# EAGLE schematic MegaShield (EAGLE 8.5.1)
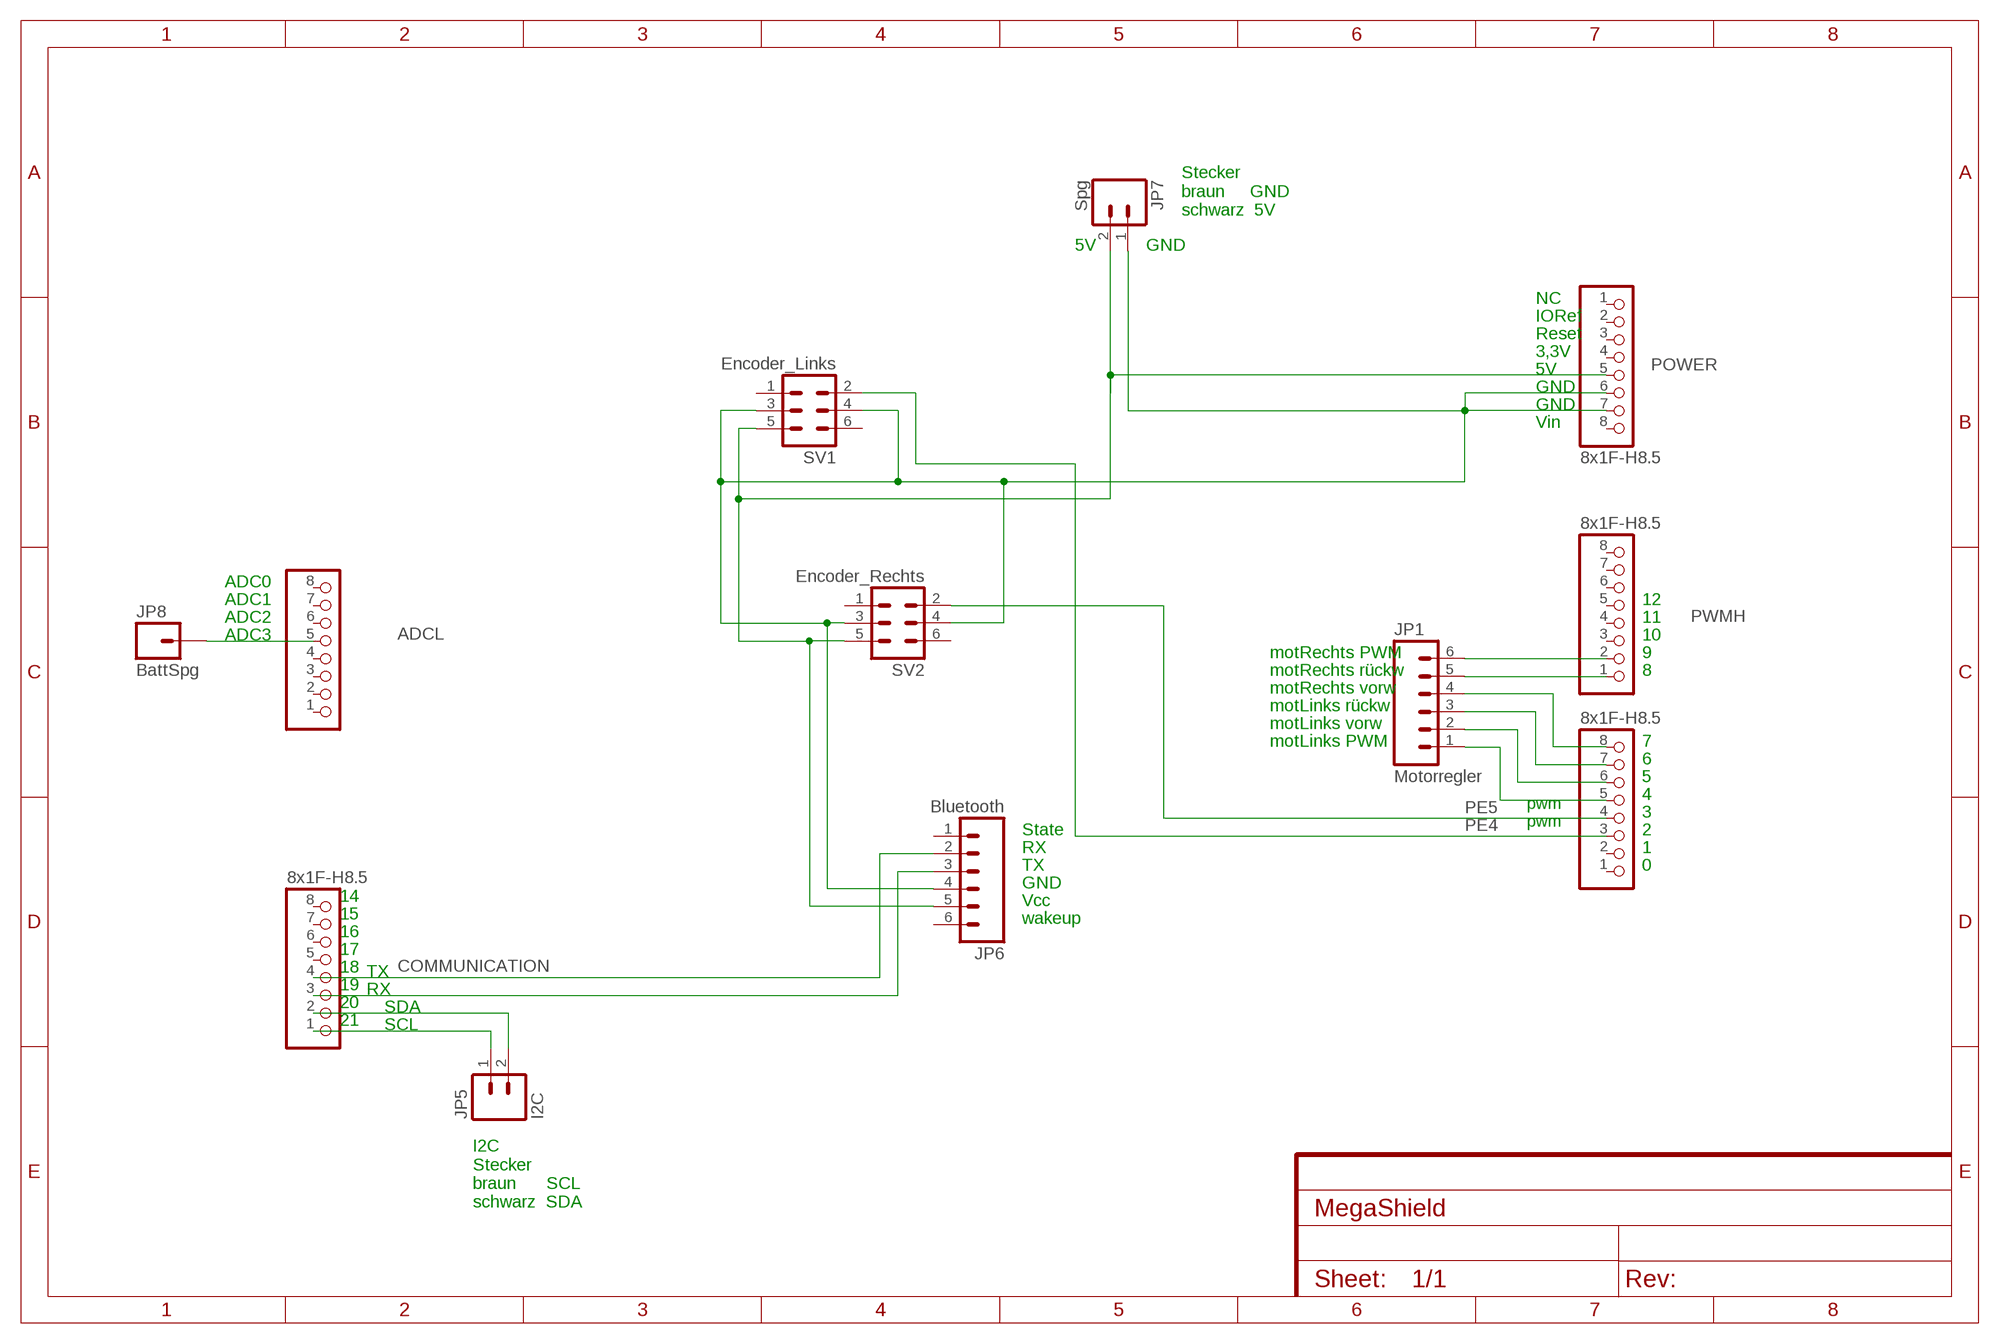
[diagram p0: schematic, sheet 1]

## Parts
ADCL  8x1F-H8.5  PINHD-1X8  [1X08]
COMMUNICATION  8x1F-H8.5  PINHD-1X8  [1X08]
JP1  Motorregler  M06LOCK  [1X06_LOCK]
JP5  I2C  M02-JST-2MM-SMT  [JST-2-SMD]
JP6  Bluetooth  M06LOCK  [1X06_LOCK]
JP7  Spg  M02-JST-2MM-SMT  [JST-2-SMD]
JP8  BattSpg  M01PTH  [1X01]
POWER  8x1F-H8.5  PINHD-1X8  [1X08]
PWMH  8x1F-H8.5  PINHD-1X8  [1X08]
PWML  8x1F-H8.5  PINHD-1X8  [1X08]
SV1  Encoder_Links  ML6  [ML6]
SV2  Encoder_Rechts  ML6  [ML6]

## Nets
N$1 [power usb]: JP6.5 JP7.2 POWER.5 SV1.5 SV2.5
N$2 [gnd]: JP6.4 JP7.1 POWER.6 POWER.7 SV1.3 SV1.4 SV2.3 SV2.4
N$3: JP1.6 PWMH.2
N$4: JP1.5 PWMH.1
N$5: ADCL.5 JP8.1
N$10: COMMUNICATION.1 JP5.1
N$11: COMMUNICATION.2 JP5.2
N$12: COMMUNICATION.3 JP6.3
N$13: COMMUNICATION.4 JP6.2
N$16: JP1.4 PWML.8
N$17: JP1.3 PWML.7
N$18: JP1.2 PWML.6
N$19: JP1.1 PWML.5
PE4: PWML.3 SV1.2
PE5: PWML.4 SV2.2
Unconnected: ADCL.1 ADCL.2 ADCL.3 ADCL.4 ADCL.6 ADCL.7 ADCL.8 COMMUNICATION.5 COMMUNICATION.6 COMMUNICATION.7 COMMUNICATION.8 JP6.1 JP6.6 POWER.1 POWER.2 POWER.3 POWER.4 POWER.8 PWMH.3 PWMH.4 PWMH.5 PWMH.6 PWMH.7 PWMH.8 PWML.1 PWML.2 SV1.1 SV1.6 SV2.1 SV2.6

## Notes on the sheet
- Stecker
  braun     GND
  schwarz  5V
- 5V | GND
- NC
- IORef
- Reset
- 3,3V
- 5V
- GND
- GND
- Vin
- ADC0
- ADC1 | 12
- ADC2 | 11
- ADC3 | 10
- motRechts PWM | 9
- motRechts rückw | 8
- motRechts vorw
- motLinks rückw
- motLinks vorw
- motLinks PWM | 7
- 6
- 5
- 4
- pwm
- 3
- pwm
- State | 2
- RX | 1
- TX | 0
- GND
- 14 | Vcc
- 15 | wakeup
- 16
- 17
- 18 | TX
- 19 | RX
- 20 | SDA
- 21 | SCL
- I2C
  Stecker
  braun      SCL
  schwarz  SDA

## Library data of the parts
ADCL COMMUNICATION POWER PWMH PWML = SmartPrj:PINHD-1X8: PIN HEADER
JP1 JP6 = SparkFun-Connectors:M06: Header 6 Standard 6-pin 0.1" header. Use with straight break away headers (SKU : PRT-00116), right angle break away headers (PRT-00553), swiss pins (PRT-00743), machine pins (PRT-00117), and female headers (PRT-00115). Molex polarized connector foot print use with SKU : PRT-08094 with associated crimp pins and housings. NOTES ON THE VARIANTS LOCK and LOCK_LONGPADS... This footprint was designed to help hold the alignment of a through-hole component (i.e. 6-pin header) while soldering it into place. You may notice that each hole has been shifted either up or down by 0.005 of an inch from it's more standard position (which is a perfectly straight line). This slight alteration caused the pins (the squares in the middle) to touch the edges of the holes. Because they are alternating, it causes a "brace" to hold the component in place. 0.005 has proven to be the perfect amount of "off-center" position when using our standard breakaway headers. Although looks a little odd when you look at the bare footprint, once you have a header in there, the alteration is very hard to notice. Also,if you push a header all the way into place, it is covered up entirely on the bottom side. This idea of altering the position of holes to aid alignment will be further integrated into the Sparkfun Library for other footprints. It can help hold any component with 3 or more connection pins.
JP5 JP7 = SparkFun-Connectors:M02: Standard 2-pin 0.1" header. Use with - straight break away headers ( PRT-00116) - right angle break away headers (PRT-00553) - swiss pins (PRT-00743) - machine pins (PRT-00117) - female headers (PRT-00115) Molex polarized connector foot print use with: PRT-08233 with associated crimp pins and housings. 2.54_SCREWTERM for use with PRT-10571. 3.5mm Screw Terminal footprints for PRT-08084 5mm Screw Terminal footprints for use with PRT-08432; PROD_ID: CONN-08352
JP8 = SparkFun-Connectors:M01: Header 1 Standard 1-pin 0.1" header. Use with straight break away headers (SKU : PRT-00116), right angle break away headers (PRT-00553), swiss pins (PRT-00743), machine pins (PRT-00117), and female headers (PRT-00115).
SV1 SV2 = con-ml:ML6: HARTING; OC_FARNELL: unknown; OC_NEWARK: unknown

## Net classes
0 default: width 0.203 mm, drill 0.406 mm, clearance 0.203 mm
1 power: width 0.61 mm, drill 0.406 mm, clearance 0.203 mm
2 gnd: width 0.305 mm, drill 0.406 mm, clearance 0.203 mm
3 power usb: width 0.508 mm, drill 0.406 mm, clearance 0.203 mm